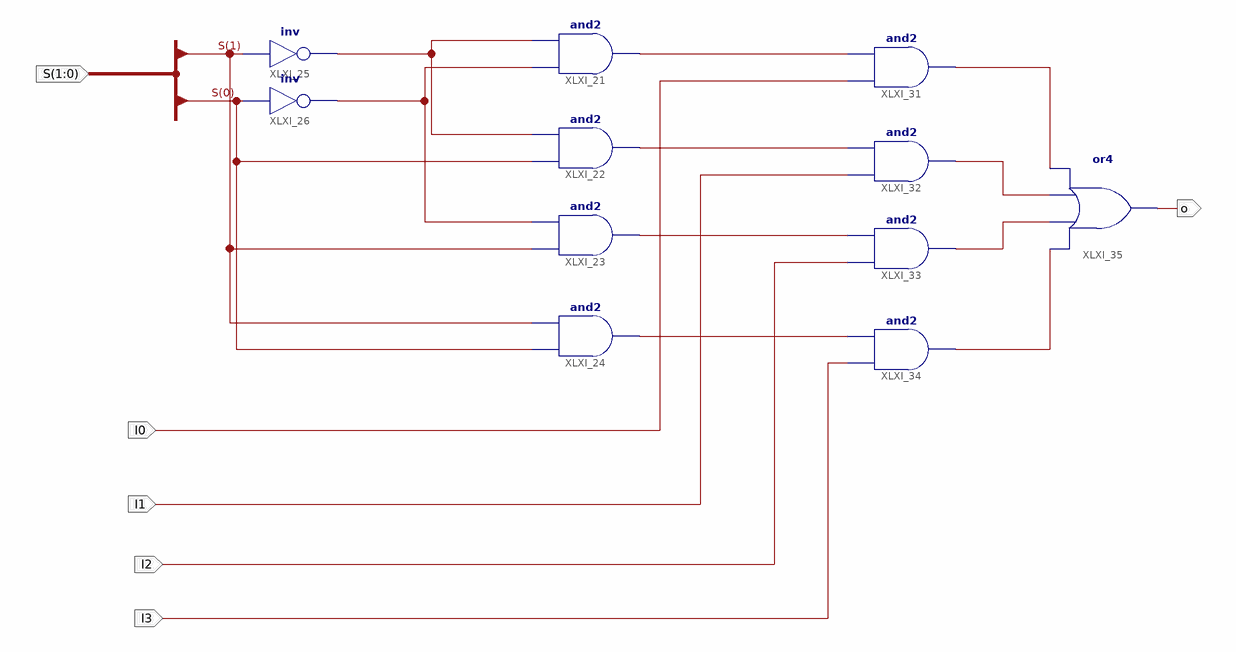
[diagram p0: schematic sheet 1]
// Xilinx ISE schematic Mux4to1.sch (kintex7) as structural Verilog: 11 symbols, 6 ports
module Mux4to1 (
  input  [1:0] S,
  input  I0,
  input  I1,
  input  I2,
  input  I3,
  output o
);

  wire XLXN_22, XLXN_24, XLXN_27, XLXN_28, XLXN_29, XLXN_30, XLXN_39, XLXN_40, XLXN_41, XLXN_42;

  and XLXI_21 (XLXN_27, XLXN_24, XLXN_22);
  and XLXI_22 (XLXN_28, S[0], XLXN_22);
  and XLXI_23 (XLXN_29, S[1], XLXN_24);
  and XLXI_24 (XLXN_30, S[0], S[1]);
  not XLXI_25 (XLXN_22, S[1]);
  not XLXI_26 (XLXN_24, S[0]);
  and XLXI_31 (XLXN_39, I0, XLXN_27);
  and XLXI_32 (XLXN_40, I1, XLXN_28);
  and XLXI_33 (XLXN_41, I2, XLXN_29);
  and XLXI_34 (XLXN_42, I3, XLXN_30);
  or XLXI_35 (o, XLXN_42, XLXN_41, XLXN_40, XLXN_39);
endmodule
